# Altium schematic sheet Sheet1.SchDoc
size A; SheetNumber: 1; SheetTotal: 1
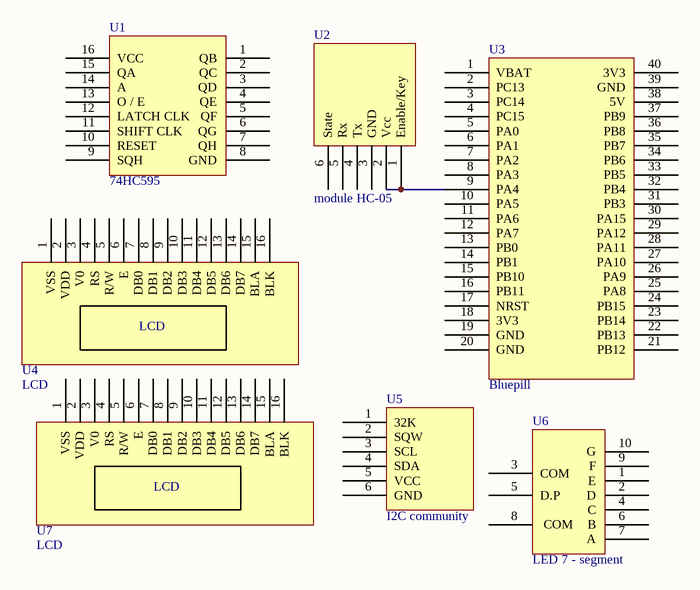
[diagram p0: Sheet1.SchDoc]

## Parts
U1  74HC595  [74HC595]
U2  module HC-05  [HC-05]
U3  Bluepill  [STM32F103C8T6]
U4  LCD  [LCD 1602]
U5  I2C community  [RTC_DS3231]
U6  LED 7 - segment  [LED 7 - segment]
U7  LCD  [LCD 2004]

## Nets
NetU2_1: U2.1(Enable/Key) U2.2(Vcc) U3.9(PA4)

Not connected (* = marked no-connect by the designer): U1 1(QB) 2(QC) 3(QD) 4(QE) 5(QF) 6(QG) 7(QH) 8(GND) 9(SQH) 10(RESET) 11(SHIFT_CLK) 12(LATCH_CLK) 13(O_/_E) 14(A) 15(QA) 16(VCC); U2 3(GND) 4(Tx) 5(Rx) 6(State); U3 1(VBAT) 2(PC13) 3(PC14) 4(PC15) 5(PA0) 6(PA1) 7(PA2) 8(PA3) 10(PA5) 11(PA6) 12(PA7) 13(PB0) 14(PB1) 15(PB10) 16(PB11) 17(NRST) 18(3V3) 19(GND) 20(GND) 21(PB12) 22(PB13) 23(PB14) 24(PB15) 25(PA8) 26(PA9) 27(PA10) 28(PA11) 29(PA12) 30(PA15) 31(PB3) 32(PB4) 33(PB5) 34(PB6) 35(PB7) 36(PB8) 37(PB9) 38(5V) 39(GND) 40(3V3); U4 1(VSS) 2(VDD) 3(V0) 4(RS) 5(R/W) 6(E) 7(DB0) 8(DB1) 9(DB2) 10(DB3) 11(DB4) 12(DB5) 13(DB6) 14(DB7) 15(BLA) 16(BLK); U5 1(32K) 2(SQW) 3(SCL) 4(SDA) 5(VCC) 6(GND); U6 1(E) 2(D) 3(COM) 4(C) 5(D.P) 6(B) 7(A) 8(_COM) 9(F) 10(G); U7 1(VSS) 2(VDD) 3(V0) 4(RS) 5(R/W) 6(E) 7(DB0) 8(DB1) 9(DB2) 10(DB3) 11(DB4) 12(DB5) 13(DB6) 14(DB7) 15(BLA) 16(BLK)

## Library data of the parts
U2 = HC-05
U3 = STM32F103C8T6
U5 = RTC DS3231